# EAGLE design AppleMouse (EAGLE 7.6.0)
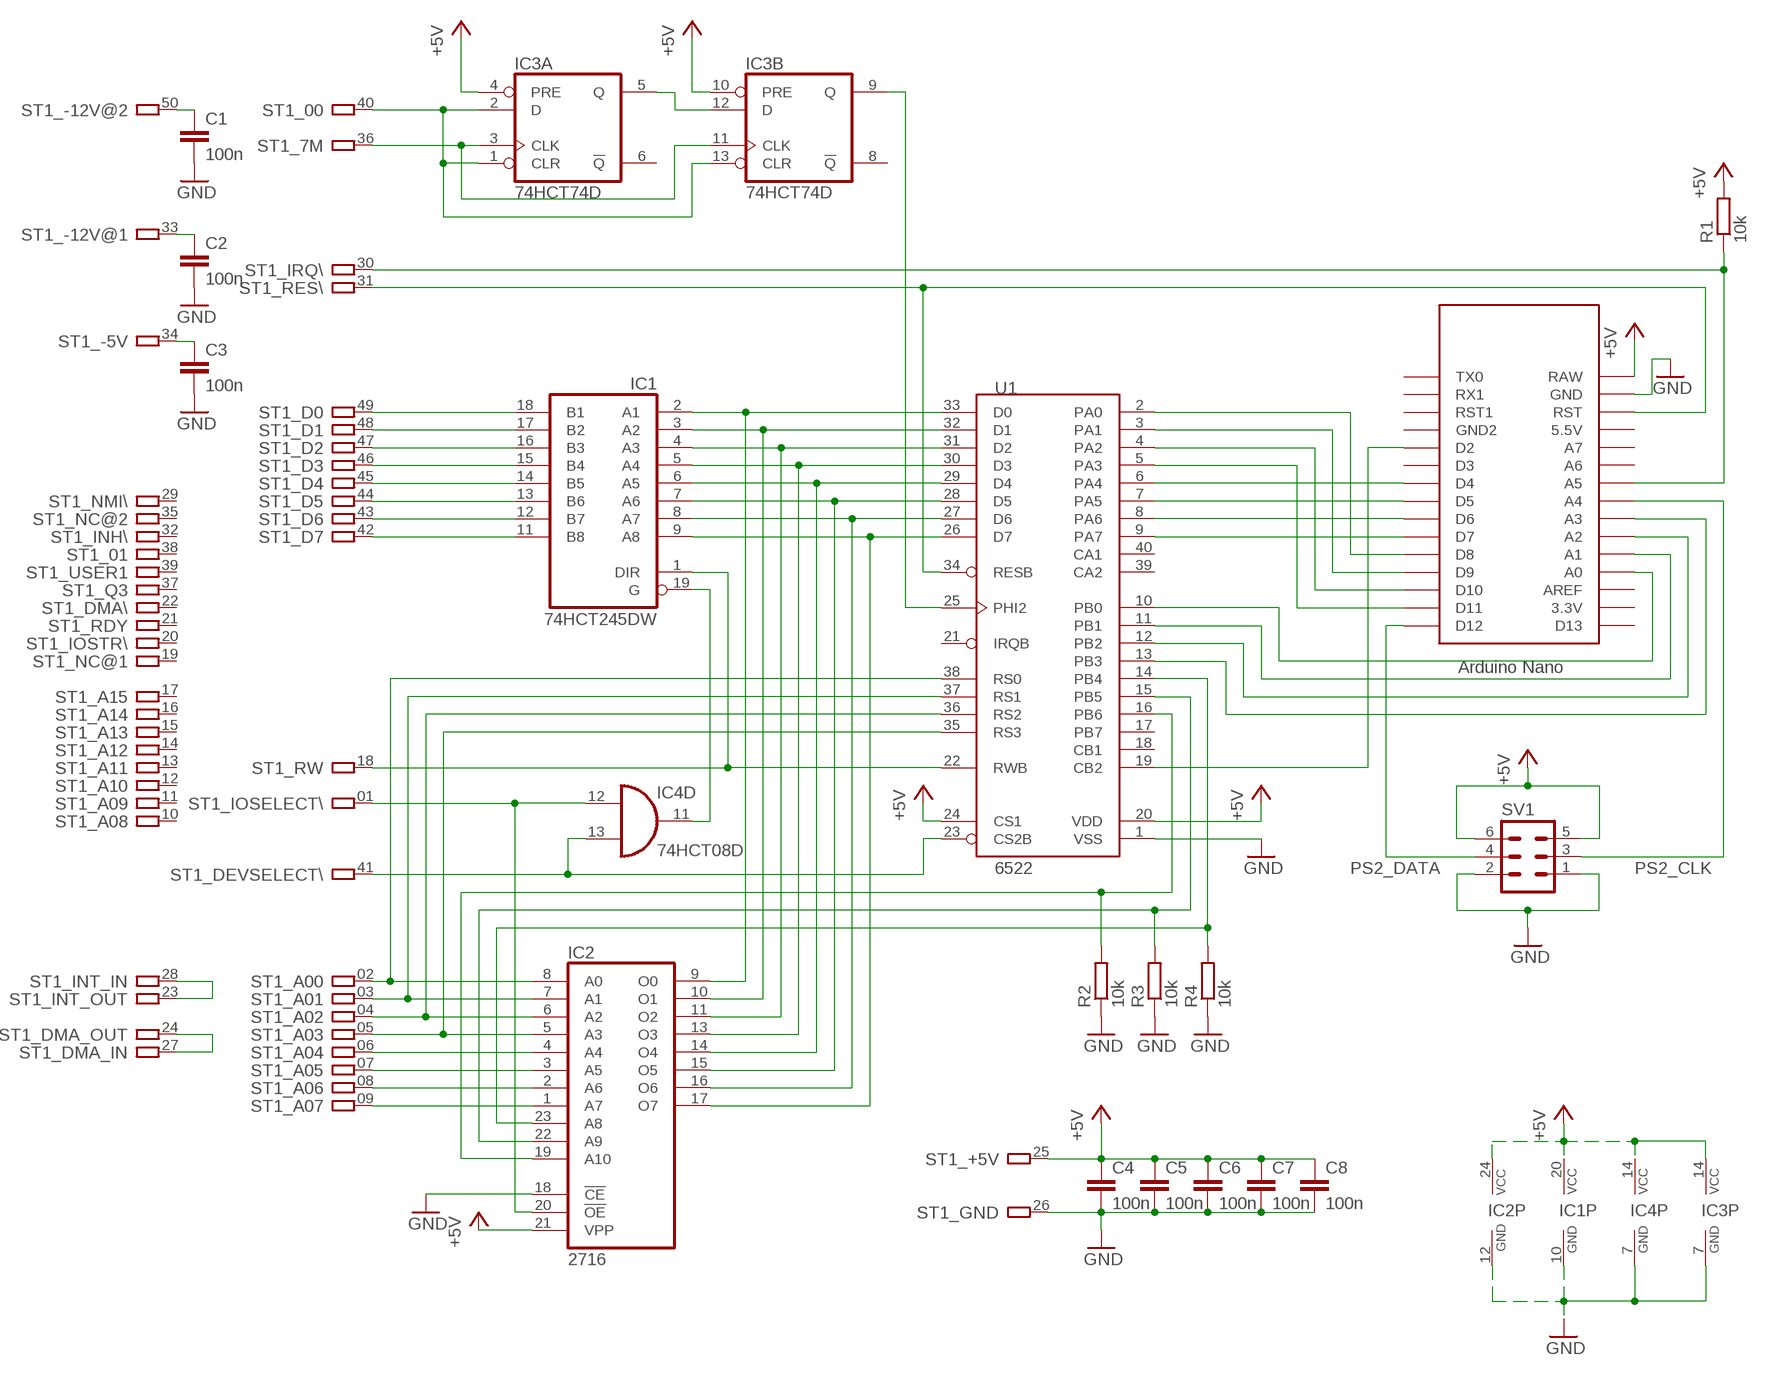
[diagram p0: schematic, sheet 1]

## Parts
C1  100n  C-EUC0805  [C0805]
C2  100n  C-EUC0805  [C0805]
C3  100n  C-EUC0805  [C0805]
C4  100n  C-EUC0805  [C0805]
C5  100n  C-EUC0805  [C0805]
C6  100n  C-EUC0805  [C0805]
C7  100n  C-EUC0805  [C0805]
C8  100n  C-EUC0805  [C0805]
IC1  74HCT245DW  [SO20W]
IC2  2716  [DIL24]
IC3  74HCT74D  [SO14]
IC4  74HCT08D  [SO14]
R1  10k  R-EU_R0805  [R0805]
R2  10k  R-EU_R0805  [R0805]
R3  10k  R-EU_R0805  [R0805]
R4  10k  R-EU_R0805  [R0805]
ST1  A2-50PINSLOT1-3  [A2-50PIN-SL1-3]
SV1  ML6  [ML6]
U1  6522  W65C22DIP40  [DIP40]
U$1  NANO  [NANO]

## Nets
+5V: C4.1 C5.1 C6.1 C7.1 C8.1 IC1.20(VCC) IC2.21(VPP) IC2.24(VCC) IC3.4(A:PRE) IC3.10(B:PRE) IC3.14(P:VCC) IC4.14(P:VCC) R1.2 ST1.25 SV1.5 SV1.6 U1.20(VDD) U1.24(CS1) U$1.RAW
GND: C1.2 C2.2 C3.2 C4.2 C5.2 C6.2 C7.2 C8.2 IC1.10(GND) IC2.12(GND) IC2.18(!CE) IC3.7(P:GND) IC4.7(P:GND) R2.1 R3.1 R4.1 ST1.26 SV1.1 SV1.2 U1.1(VSS) U$1.GND
N$1: IC1.18(B1) ST1.49
N$2: IC1.17(B2) ST1.48
N$3: IC1.16(B3) ST1.47
N$4: IC1.15(B4) ST1.46
N$5: IC1.14(B5) ST1.45
N$6: IC1.13(B6) ST1.44
N$7: IC1.12(B7) ST1.43
N$8: IC1.11(B8) ST1.42
N$9: IC1.5(A4) IC2.13(O3) U1.30(D3)
N$10: IC1.4(A3) IC2.11(O2) U1.31(D2)
N$11: IC1.3(A2) IC2.10(O1) U1.32(D1)
N$12: IC1.2(A1) IC2.9(O0) U1.33(D0)
N$13: IC1.9(A8) IC2.17(O7) U1.26(D7)
N$14: IC1.7(A6) IC2.15(O5) U1.28(D5)
N$15: IC1.8(A7) IC2.16(O6) U1.27(D6)
N$16: R1.1 ST1.30 U$1.A5
N$17: ST1.31 U1.34(RESB) U$1.RST
N$18: U1.13(PB3) U$1.A3
N$19: IC2.20(!OE) IC4.12(D:I0) ST1.01
N$20: U1.10(PB0) U$1.A0
N$21: IC2.7(A1) ST1.03 U1.37(RS1)
N$22: U1.12(PB2) U$1.A2
N$23: IC2.5(A3) ST1.05 U1.35(RS3)
N$24: IC2.4(A4) ST1.06
N$25: IC2.3(A5) ST1.07
N$26: IC2.2(A6) ST1.08
N$27: IC2.1(A7) ST1.09
N$28: IC1.1(DIR) ST1.18 U1.22(RWB)
N$29: C1.1 ST1.50
N$30: C2.1 ST1.33
N$31: ST1.24 ST1.27
N$32: ST1.23 ST1.28
N$33: C3.1 ST1.34
N$34: U1.19(CB2) U$1.D2
N$35: IC2.8(A0) ST1.02 U1.38(RS0)
N$36: U1.11(PB1) U$1.A1
N$37: IC4.13(D:I1) ST1.41 U1.23(CS2B)
N$38: IC2.6(A2) ST1.04 U1.36(RS2)
N$39: IC1.6(A5) IC2.14(O4) U1.29(D4)
N$40: U1.3(PA1) U$1.D9
N$41: U1.2(PA0) U$1.D8
N$42: U1.4(PA2) U$1.D10
N$43: U1.5(PA3) U$1.D11
N$44: U1.6(PA4) U$1.D4
N$45: U1.7(PA5) U$1.D5
N$46: U1.8(PA6) U$1.D6
N$47: U1.9(PA7) U$1.D7
N$48: IC3.9(B:Q) U1.25(PHI2)
N$49: IC2.23(A8) R4.2 U1.14(PB4)
N$50: IC2.22(A9) R3.2 U1.15(PB5)
N$51: IC2.19(A10) R2.2 U1.16(PB6)
N$52: IC1.19(G) IC4.11(D:O)
N$53: IC3.5(A:Q) IC3.12(B:D)
N$54: IC3.1(A:CLR) IC3.2(A:D) IC3.13(B:CLR) ST1.40
N$55: IC3.3(A:CLK) IC3.11(B:CLK) ST1.36
PS2_CLK: SV1.3 U$1.A4
PS2_DATA: SV1.4 U$1.D12
Unconnected: IC3.6(A:!Q) IC3.8(B:!Q) IC4.1(A:I0) IC4.2(A:I1) IC4.3(A:O) IC4.4(B:I0) IC4.5(B:I1) IC4.6(B:O) IC4.8(C:O) IC4.9(C:I0) IC4.10(C:I1) ST1.10 ST1.11 ST1.12 ST1.13 ST1.14 ST1.15 ST1.16 ST1.17 ST1.19 ST1.20 ST1.21 ST1.22 ST1.29 ST1.32 ST1.35 ST1.37 ST1.38 ST1.39 U1.17(PB7) U1.18(CB1) U1.21(IRQB) U1.39(CA2) U1.40(CA1) U$1.3.3V U$1.5V(5.5V) U$1.A6 U$1.A7 U$1.AREF U$1.D3 U$1.D13 U$1.GND1(GND2) U$1.ICSP1 U$1.ICSP2 U$1.ICSP3 U$1.ICSP4 U$1.ICSP5 U$1.ICSP6 U$1.RST1 U$1.RX1 U$1.TX0

## Library data of the parts
C1-C8 = rcl:C-EU: CAPACITOR, European symbol
IC1 = 74xx-eu:74*245: Octal BUS TRANSCEIVER, 3-state
IC2 = memory:2716: MEMORY
IC3 = 74xx-eu:74*74: Dual D type positive edge triggered FLIP FLOP, preset and clear
IC4 = 74xx-eu:74*08: Quad 2-input AND gate
R1-R4 = rcl:R-EU_: RESISTOR, European symbol
ST1 = con-apple2:A2-50PIN: Apple ][ Peripheral Card Connector This is the, default, 50-pin connector for slot #1 to #7 Pins are laid out as seen from the top of the slot
SV1 = con-harting-ml:ML6: HARTING; OC_FARNELL: unknown; OC_NEWARK: unknown
U1 = pda:W65C22: The W65C22 (W65C22N and W65C22S) Versatile Interface Adapter (VIA) is a flexible I/O device for use with the 65xx series microprocessor family. The W65C22 includes functions for programmed control of two peripheral ports (Ports A and B). Two program controlled 8-bit bidirectional peripheral I/O ports allow direct interfacing between the microprocessor and selected peripheral units. Each port has input data latching capability. Two programmable Data Direction Registers (A and B) allow selection of data direction (input or output) on an individual line basis. Also provided are two programmable 16-bit Interval Timer/Counters with latches. Timer 1 may be operated in a One-Shot Interrupt Mode with interrupts on each count to zero, or in a Free-Run Mode with a continuous series of evenly spaced interrupts. Timer 2 functions as both an interval and pulse counter. Serial Data transfers are provided by a serial to parallel/parallel to serial shift register. Application versatility is further increased by various control registers, including an Interrupt Flag Register, an Interrupt Enable Register and two Function Control Registers.
U$1 = Arduino-clone:NANO: Arduino Nano

## Board
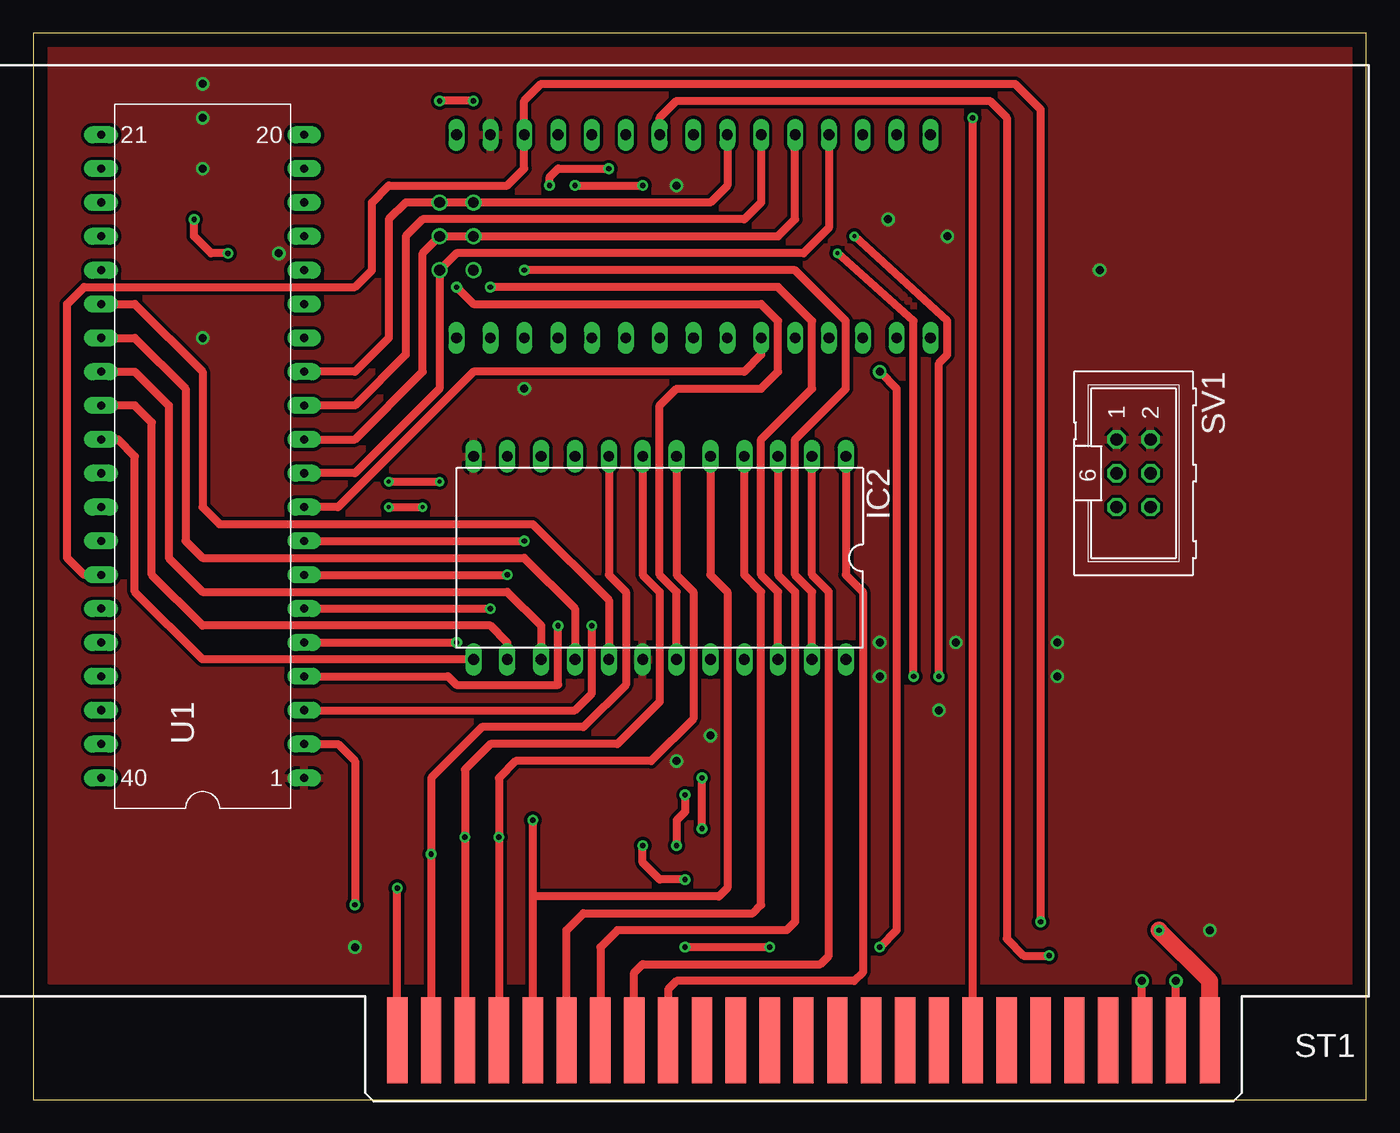
[diagram p1: board, top side]
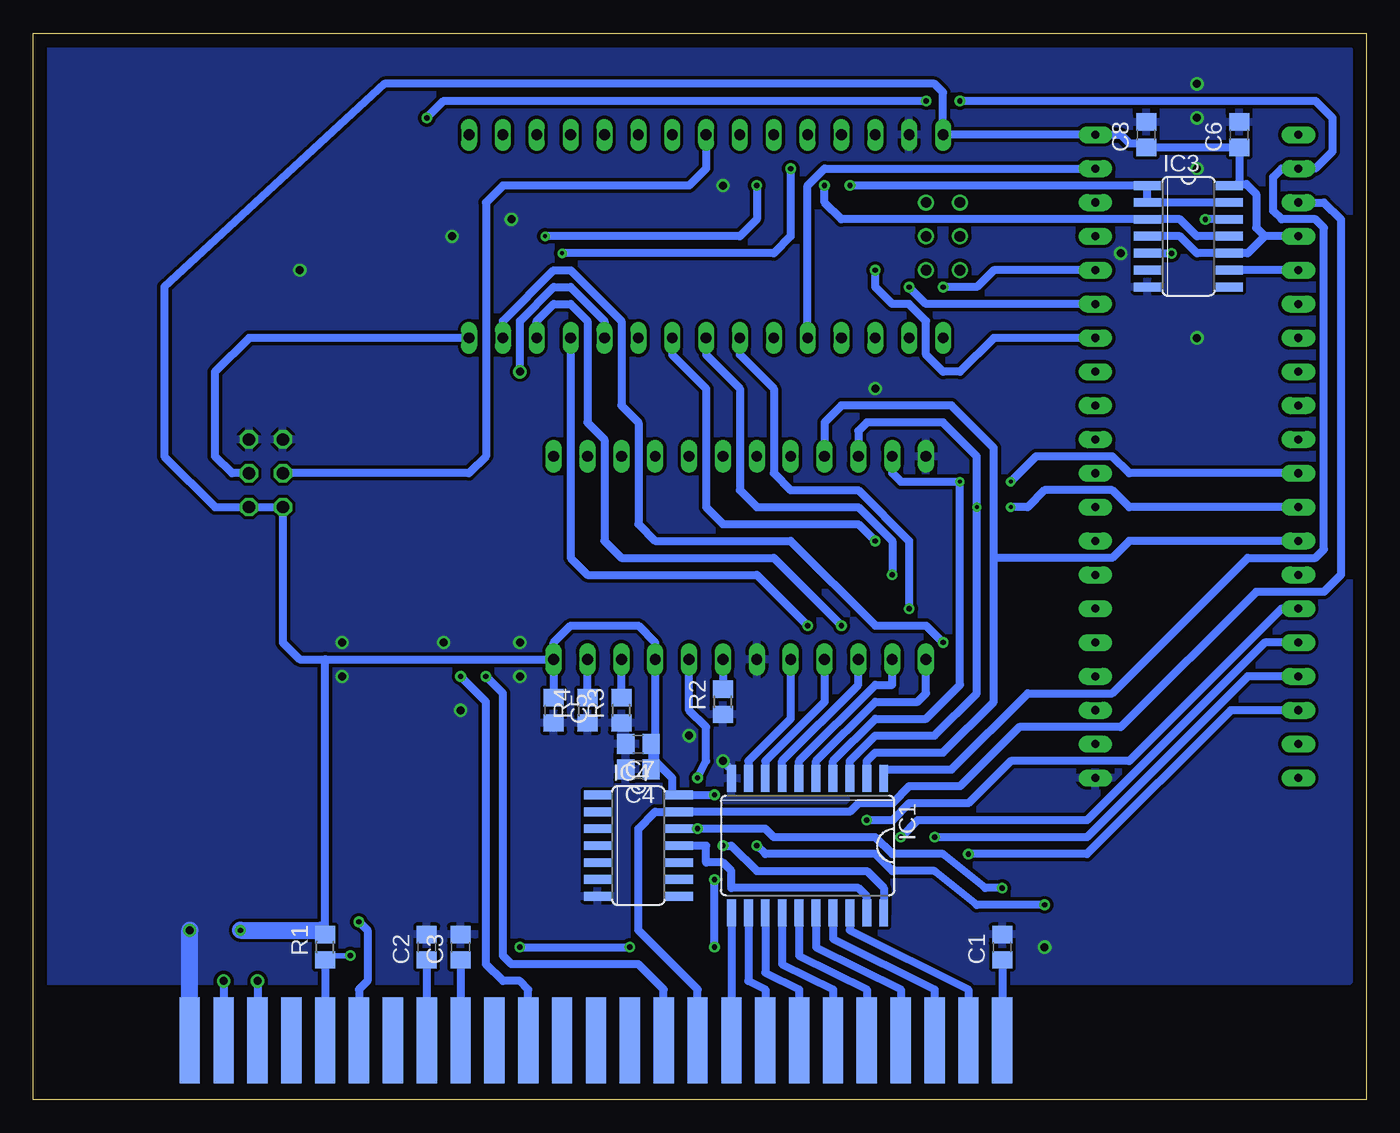
[diagram p2: board, bottom side, seen from below]

Size 100 x 80 mm. Coordinates in mm from the lower left corner, seen from the top.
Outline: 0,0 100,0 100,80 0,80 0,0
Copper layers (1*16): Top 0.035mm / dielectric 1.5mm / Bottom 0.035mm
Design rules "default *": minimum track width 10mil, minimum drill 24mil, track to track 6mil, track to pad 6mil, pad to pad 6mil, via to via 8mil, smd to smd 0mil, copper to edge 40mil, drill to drill 8mil, minimum pad ring 0.2mm, minimum via ring 0.2mm, stop-mask expansion 4mil, vias tented up to drill 0mil, thermal gap 10mil

### Footprints (pad centres in the part's own frame; a part is rotated, then mirrored left to right if it is on the bottom)
C0805 = smd 1.3 x 1.5: 1 -0.95,0; 2 0.95,0
SO20W = smd 0.66 x 2.032: 1 -5.715,-5.029; 2 -4.445,-5.029; 3 -3.175,-5.029; 4 -1.905,-5.029; 5 -0.635,-5.029; 6 0.635,-5.029; 7 1.905,-5.029; 8 3.175,-5.029; 9 4.445,-5.029; 10 5.715,-5.029; 11 5.715,5.029; 12 4.445,5.029; 13 3.175,5.029; 14 1.905,5.029; 15 0.635,5.029; 16 -0.635,5.029; 17 -1.905,5.029; 18 -3.175,5.029; 19 -4.445,5.029; 20 -5.715,5.029
DIL24 = drill 0.813 long: 1 -13.97,-7.62; 2 -11.43,-7.62; 3 -8.89,-7.62; 4 -6.35,-7.62; 5 -3.81,-7.62; 6 -1.27,-7.62; 7 1.27,-7.62; 8 3.81,-7.62; 9 6.35,-7.62; 10 8.89,-7.62; 11 11.43,-7.62; 12 13.97,-7.62; 13 13.97,7.62; 14 11.43,7.62; 15 8.89,7.62; 16 6.35,7.62; 17 3.81,7.62; 18 1.27,7.62; 19 -1.27,7.62; 20 -3.81,7.62; 21 -6.35,7.62; 22 -8.89,7.62; 23 -11.43,7.62; 24 -13.97,7.62
SO14 = smd 0.66 x 2.032: 1 -3.81,-3.073; 2 -2.54,-3.073; 3 -1.27,-3.073; 4 0,-3.073; 5 1.27,-3.073; 6 2.54,-3.073; 7 3.81,-3.073; 8 3.81,3.073; 9 2.54,3.073; 10 1.27,3.073; 11 0,3.073; 12 -1.27,3.073; 13 -2.54,3.073; 14 -3.81,3.073
R0805 = smd 1.3 x 1.5: 1 -0.95,0; 2 0.95,0
A2-50PIN-SL1-3 = smd 1.524 x 6.477: 01 -73.025,4.445; 02 -70.485,4.445; 03 -67.945,4.445; 04 -65.405,4.445; 05 -62.865,4.445; 06 -60.325,4.445; 07 -57.785,4.445; 08 -55.245,4.445; 09 -52.705,4.445; 10 -50.165,4.445; 11 -47.625,4.445; 12 -45.085,4.445; 13 -42.545,4.445; 14 -40.005,4.445; 15 -37.465,4.445; 16 -34.925,4.445; 17 -32.385,4.445; 18 -29.845,4.445; 19 -27.305,4.445; 20 -24.765,4.445; 21 -22.225,4.445; 22 -19.685,4.445; 23 -17.145,4.445; 24 -14.605,4.445; 25 -12.065,4.445 | smd 1.524 x 6.477 bottom: 26 -12.065,4.445; 27 -14.605,4.445; 28 -17.145,4.445; 29 -19.685,4.445; 30 -22.225,4.445; 31 -24.765,4.445; 32 -27.305,4.445; 33 -29.845,4.445; 34 -32.385,4.445; 35 -34.925,4.445; 36 -37.465,4.445; 37 -40.005,4.445; 38 -42.545,4.445; 39 -45.085,4.445; 40 -47.625,4.445; 41 -50.165,4.445; 42 -52.705,4.445; 43 -55.245,4.445; 44 -57.785,4.445; 45 -60.325,4.445; 46 -62.865,4.445; 47 -65.405,4.445; 48 -67.945,4.445; 49 -70.485,4.445; 50 -73.025,4.445
ML6 = drill 0.914 octagon: 1 -2.54,-1.27; 2 -2.54,1.27; 3 0,-1.27; 4 0,1.27; 5 2.54,-1.27; 6 2.54,1.27
DIP40 = drill 0.61 pad 1.27 long: 1 -24.13,-7.62; 2 -21.59,-7.62; 3 -19.05,-7.62; 4 -16.51,-7.62; 5 -13.97,-7.62; 6 -11.43,-7.62; 7 -8.89,-7.62; 8 -6.35,-7.62; 9 -3.81,-7.62; 10 -1.27,-7.62; 11 1.27,-7.62; 12 3.81,-7.62; 13 6.35,-7.62; 14 8.89,-7.62; 15 11.43,-7.62; 16 13.97,-7.62; 17 16.51,-7.62; 18 19.05,-7.62; 19 21.59,-7.62; 20 24.13,-7.62; 21 24.13,7.62; 22 21.59,7.62; 23 19.05,7.62; 24 16.51,7.62; 25 13.97,7.62; 26 11.43,7.62; 27 8.89,7.62; 28 6.35,7.62; 29 3.81,7.62; 30 1.27,7.62; 31 -1.27,7.62; 32 -3.81,7.62; 33 -6.35,7.62; 34 -8.89,7.62; 35 -11.43,7.62; 36 -13.97,7.62; 37 -16.51,7.62; 38 -19.05,7.62; 39 -21.59,7.62; 40 -24.13,7.62
NANO = drill 0.8 long: 3.3V -10.16,24.13; 5V -10.16,-1.27; A0 -10.16,19.05; A1 -10.16,16.51; A2 -10.16,13.97; A3 -10.16,11.43; A4 -10.16,8.89; A5 -10.16,6.35; A6 -10.16,3.81; A7 -10.16,1.27; AREF -10.16,21.59; D2 5.08,1.27; D3 5.08,3.81; D4 5.08,6.35; D5 5.08,8.89; D6 5.08,11.43; D7 5.08,13.97; D8 5.08,16.51; D9 5.08,19.05; D10 5.08,21.59; D11 5.08,24.13; D12 5.08,26.67; D13 -10.16,26.67; GND -10.16,-6.35; GND1 5.08,-1.27; RAW -10.16,-8.89; RST -10.16,-3.81; RST1 5.08,-3.81; RX1 5.08,-6.35; TX0 5.08,-8.89 | drill 0.8: ICSP1 -5.08,-10.16; ICSP2 -5.08,-7.62; ICSP3 -2.54,-10.16; ICSP4 -2.54,-7.62; ICSP5 0,-10.16; ICSP6 0,-7.62

### Placement (x,y rotation side)
C1  27.3,11.43 90 bottom
C2  70.48,11.43 90 bottom
C3  67.94,11.43 90 bottom
C4  54.61,24.77 180 bottom
C5  60.96,29.21 270 bottom
C6  9.53,72.39 90 bottom
C7  54.61,26.67 180 bottom
C8  16.51,72.39 90 bottom
IC1  41.91,19.05 180 bottom
IC2  46.99,40.64 180 top
IC3  13.34,64.77 270 bottom
IC4  54.61,19.05 270 bottom
R1  78.11,11.43 90 bottom
R2  48.26,29.84 90 bottom
R3  55.88,29.21 90 bottom
R4  58.42,29.21 90 bottom
ST1  100.33,0 0 top
SV1  82.55,46.99 270 top
U1  12.7,48.26 90 top
U$1  40.64,62.23 270 top

### Tracks (layer width: path | path; a pad name or v marks a point on that pad's centre or on a via)
+5V  (via drill 0.4)
  Top 0.61: v48.9,22.86 48.9,21.59 48.26,20.95 v48.26,19.05
  Top 1.27: ST1.25 88.27,8.89 v84.45,12.7
  Bottom 0.406: C7.1 C4.1 52.7,24.77
  Bottom 0.61: 36.14,13.97 IC1.20 36.2,15.88 37.47,17.14 45.72,17.14 47.62,19.05 v48.26,19.05 | U1.24 7.62,64.77 | 7.62,64.77 8.89,63.5 IC3.10 12.7,63.5 13.97,64.77 IC3.4 | 9.53,68.68 C6.1 C8.1 16.82,71.75 17.78,71.75 18.41,72.39 U1.20 U$1.RAW 31.75,75.56 32.38,76.2 73.66,76.2 90.17,60.96 90.17,48.26 86.36,44.45 SV1.6 SV1.5 81.28,34.29 80.01,33.02 78.11,33.02 | 9.53,68.68 IC3.14 | 9.53,68.68 8.99,68.68 8.26,67.94 8.26,65.41 7.62,64.77 | IC2.24 C5.1 | 78.11,33.02 IC2.24 | IC2.24 60.96,34.29 59.69,35.56 54.61,35.56 53.34,34.29 IC2.21 53.34,25.4 52.7,24.77 52.07,24.13 52.07,22.86 IC4.14 v48.9,22.86 | R1.2 78.11,33.02
  Bottom 1.27: v84.45,12.7 78.42,12.7 R1.2
GND  (via drill 0.6)
  Bottom 0.61: 47.94,25.08 47.62,24.77
  Bottom 1.27: ST1.26 v88.27,12.7
  other vias: 50.8,27.3 48.26,25.4 12.7,57.15 80.01,62.23 68.58,64.77 64.14,66.04 48.26,68.58 36.83,53.34 69.22,34.29 67.94,29.21 24.13,11.43 76.83,34.29 76.83,31.75 63.5,34.29 63.5,31.75 12.7,76.2 12.7,73.66 12.7,69.85 18.41,63.5
  pour Bottom (isolate 0.25): 1.27,78.74 99.06,78.74 99.06,8.89 1.27,8.89
  pour Top (isolate 0.25): 1.27,78.74 99.06,78.74 99.06,8.89 1.27,8.89
N$1
  Bottom 0.61: IC1.18 38.73,12.7 29.84,8.26 ST1.49
N$2
  Bottom 0.61: IC1.17 40.01,12.06 32.38,8.26 ST1.48
N$3
  Bottom 0.61: IC1.16 41.27,11.43 34.92,8.26 ST1.47
N$4
  Bottom 0.61: IC1.15 42.55,10.79 37.47,8.26 ST1.46
N$5
  Bottom 0.61: IC1.14 43.81,10.16 40.01,8.26 ST1.45
N$6
  Bottom 0.61: IC1.13 45.09,9.53 42.55,8.26 ST1.44
N$7
  Bottom 0.61: IC1.12 46.35,8.89 45.09,8.26 ST1.43
N$8
  Bottom 0.61: IC1.11 ST1.42
N$9
  Top 0.61: IC2.13 12.7,33.02 7.62,38.1 7.62,48.26 6.35,49.53 U1.30
  Bottom 0.61: IC1.5 41.27,25.4 36.83,29.84 33.66,29.84 33.02,30.48 IC2.13
N$10  (via drill 0.3)
  Top 0.61: v26.67,46.35 v30.48,46.35
  Bottom 0.61: IC1.4 40.01,25.4 36.83,28.57 33.02,28.57 30.48,31.11 v30.48,46.35 34.92,46.35 35.56,46.99 IC2.11 | U1.31 17.78,46.99 19.05,48.26 24.77,48.26 v26.67,46.35
N$11  (via drill 0.3)
  Top 0.61: v26.67,44.45 v29.21,44.45
  Bottom 0.61: IC1.3 38.73,25.4 36.83,27.3 32.38,27.3 29.21,30.48 v29.21,44.45 29.21,48.26 31.75,50.8 37.47,50.8 38.1,50.16 IC2.10 | U1.32 17.78,44.45 19.05,45.72 24.13,45.72 25.4,44.45 v26.67,44.45
N$12
  Bottom 0.61: IC1.2 37.47,25.4 36.83,26.04 31.75,26.04 27.94,29.84 27.94,40.64 | 27.94,40.64 27.94,48.9 31.11,52.07 39.37,52.07 40.64,50.8 IC2.9 | U1.33 17.78,41.91 19.05,40.64 27.94,40.64
N$13
  Top 0.61: U1.26 7.62,59.69 12.7,54.61 12.7,44.45 13.97,43.18 37.47,43.18 43.18,37.47 IC2.17
  Bottom 0.61: IC2.17 43.18,28.57 46.35,25.4 IC1.9
N$14
  Top 0.61: U1.28 7.62,54.61 10.16,52.07 10.16,40.64 12.7,38.1 35.56,38.1 38.1,35.56 IC2.15
  Bottom 0.61: IC1.7 43.81,25.4 38.1,31.11 IC2.15
N$15
  Top 0.61: U1.27 7.62,57.15 11.43,53.34 11.43,41.91 12.7,40.64 36.83,40.64 40.64,36.83 IC2.16
  Bottom 0.61: IC2.16 40.64,29.84 45.09,25.4 IC1.8
N$16  (via drill 0.4)
  Top 0.61: U$1.A5 46.99,73.66 48.26,74.93 71.75,74.93 73.03,73.66 73.03,12.06 74.3,10.79 v76.2,10.79
  Bottom 0.406: v76.2,10.79 77.79,10.79 R1.1
  Bottom 0.61: R1.1 ST1.30
N$17  (via drill 0.4)
  Top 0.61: U1.34 3.81,39.37 2.54,40.64 2.54,59.69 3.81,60.96 24.13,60.96 25.4,62.23 25.4,67.31 26.67,68.58 35.56,68.58 36.83,69.85 U$1.RST 36.83,74.93 38.1,76.2 73.66,76.2 75.56,74.3 v75.56,13.34
  Bottom 0.61: v75.56,13.34 74.93,12.7 74.93,8.89 75.56,8.26 ST1.31
N$18
  Top 0.61: U$1.A3 52.07,68.58 50.8,67.31 27.94,67.31 26.67,66.04 26.67,57.15 24.13,54.61 U1.13
N$19  (via drill 0.4)
  Top 0.61: ST1.01 v27.3,15.88 | v50.16,20.32 v50.16,24.13
  Bottom 0.61: IC2.20 50.8,29.21 49.53,27.94 49.53,25.4 v50.16,24.13 | v27.3,15.88 28.57,15.88 31.75,18.41 35.56,18.41 36.83,19.68 44.45,19.68 45.09,20.32 v50.16,20.32 IC4.12
N$20
  Top 0.61: U$1.A0 59.69,65.41 57.78,63.5 31.75,63.5 30.48,62.23 30.48,53.34 24.13,46.99 U1.10
N$21  (via drill 0.4)
  Top 0.61: IC2.7 45.72,39.37 46.99,38.1 46.99,29.84 43.81,26.67 34.29,26.67 32.38,24.77 v32.38,19.68 ST1.03
  Bottom 0.61: U1.37 8.89,31.75 20.95,19.68 v32.38,19.68
N$22
  Top 0.61: U$1.A2 54.61,67.31 53.34,66.04 29.21,66.04 27.94,64.77 27.94,55.88 24.13,52.07 U1.12
N$23  (via drill 0.4)
  Top 0.61: IC2.5 50.8,39.37 52.07,38.1 52.07,15.88 51.44,15.24 37.47,15.24 | 37.47,15.24 ST1.05 | v37.47,20.95 37.47,15.24
  Bottom 0.61: U1.35 6.35,36.83 17.78,25.4 26.67,25.4 29.84,22.23 34.29,22.23 35.56,20.95 v37.47,20.95
N$24
  Top 0.61: ST1.06 40.01,12.7 41.27,13.97 53.98,13.97 54.61,14.61 54.61,38.1 53.34,39.37 IC2.4
N$25
  Top 0.61: IC2.3 55.88,39.37 57.15,38.1 57.15,13.34 56.52,12.7 43.81,12.7 42.55,11.43 ST1.07
N$26
  Top 0.61: ST1.08 45.09,9.53 45.72,10.16 59.05,10.16 59.69,10.79 59.69,38.1 58.42,39.37 IC2.2
N$27
  Top 0.61: IC2.1 60.96,39.37 62.23,38.1 62.23,9.53 61.59,8.89 48.26,8.89 47.62,8.26 ST1.09
N$28  (via drill 0.4)
  Top 0.61: ST1.18 v70.48,73.66 | v33.02,74.93 v30.48,74.93
  Bottom 0.61: IC1.1 36.2,24.77 31.11,24.77 25.4,30.48 19.05,30.48 8.89,40.64 3.81,40.64 3.17,41.27 3.17,65.41 3.81,66.04 6.35,66.04 6.99,66.67 6.99,69.22 6.35,69.85 U1.22 3.81,69.85 2.54,71.12 2.54,73.66 3.81,74.93 v30.48,74.93 | v70.48,73.66 69.22,74.93 v33.02,74.93
N$29
  Bottom 0.61: C1.1 ST1.50
N$30
  Bottom 0.61: C2.1 ST1.33
N$31  (via drill 0.6)
  Top 0.61: ST1.27 v85.72,8.89
  Bottom 0.61: v85.72,8.89 ST1.27
N$32  (via drill 0.6)
  Top 0.61: ST1.23 v83.19,8.89
  Bottom 0.61: v83.19,8.89 ST1.23
N$33
  Bottom 0.61: C3.1 ST1.34
N$34
  Bottom 0.61: U$1.D2 41.91,68.58 40.64,69.85 U1.19
N$35  (via drill 0.4)
  Top 0.61: IC2.8 43.18,39.37 44.45,38.1 44.45,31.11 41.27,27.94 33.66,27.94 29.84,24.13 v29.84,18.41 ST1.02
  Bottom 0.61: U1.38 10.16,29.21 20.95,18.41 v29.84,18.41
N$36
  Top 0.61: U1.11 24.13,49.53 29.21,54.61 29.21,63.5 30.48,64.77 55.88,64.77 57.15,66.04 U$1.A1
N$37
  Bottom 0.61: ST1.41 50.16,8.26 54.61,12.7 54.61,20.32 53.34,21.59 IC4.13 38.73,21.59 38.1,22.23 35.56,22.23 34.29,23.5 30.48,23.5 26.04,27.94 18.41,27.94 8.26,38.1 3.17,38.1 1.91,39.37 1.91,66.04 3.17,67.31 U1.23
N$38  (via drill 0.4)
  Top 0.61: IC2.6 48.26,39.37 49.53,38.1 49.53,28.57 46.35,25.4 36.2,25.4 34.92,24.13 v34.92,19.68 ST1.04
  Bottom 0.61: U1.36 7.62,34.29 20.95,20.95 33.66,20.95 v34.92,19.68
N$39
  Top 0.61: IC2.14 35.56,34.29 34.29,35.56 12.7,35.56 8.89,39.37 8.89,50.8 7.62,52.07 U1.29
  Bottom 0.61: IC1.6 42.55,25.4 36.83,31.11 35.56,31.11 IC2.14
N$40  (via drill 0.4)
  Top 0.61: U1.3 40.64,29.21 41.91,30.48 v41.91,35.56
  Bottom 0.61: U$1.D9 59.69,40.64 58.42,39.37 45.72,39.37 v41.91,35.56
N$41  (via drill 0.4, 0.6)
  Top 0.61: v63.5,54.61 64.77,53.34 64.77,12.7 v63.5,11.43 | U1.2 22.86,26.67 24.13,25.4 v24.13,14.61 | v55.24,11.43 v48.9,11.43 | v48.9,16.51 46.99,16.51 45.72,17.78 v45.72,19.05
  Bottom 0.61: v24.13,14.61 29.21,14.61 32.38,17.14 35.56,17.14 36.83,18.41 45.09,18.41 v45.72,19.05 | v63.5,11.43 v55.24,11.43 | v48.9,11.43 v48.9,16.51 | v63.5,54.61 63.5,58.42 60.96,60.96 59.69,60.96 57.15,58.42 U$1.D8
N$42  (via drill 0.4)
  Top 0.61: U1.4 31.11,31.75 31.75,31.11 39.37,31.11 v39.37,35.56
  Bottom 0.61: U$1.D10 62.23,58.42 60.96,59.69 59.69,59.69 58.42,58.42 58.42,50.8 57.15,49.53 57.15,41.91 55.88,40.64 44.45,40.64 v39.37,35.56
N$43  (via drill 0.4)
  Top 0.61: U1.5 v31.75,34.29
  Bottom 0.61: U$1.D11 64.77,58.42 60.96,62.23 59.69,62.23 55.88,58.42 55.88,52.07 54.61,50.8 54.61,43.18 53.34,41.91 43.18,41.91 36.83,35.56 33.02,35.56 v31.75,34.29
N$44  (via drill 0.4)
  Top 0.61: U1.6 v34.29,36.83
  Bottom 0.61: v34.29,36.83 34.29,41.91 38.1,45.72 43.18,45.72 44.45,46.99 44.45,53.34 46.99,55.88 U$1.D4
N$45  (via drill 0.4)
  Top 0.61: U1.7 v35.56,39.37
  Bottom 0.61: v35.56,39.37 35.56,41.91 38.1,44.45 45.72,44.45 46.99,45.72 46.99,53.34 49.53,55.88 U$1.D5
N$46  (via drill 0.4)
  Top 0.61: U1.8 v36.83,41.91
  Bottom 0.61: v36.83,41.91 38.1,43.18 48.26,43.18 49.53,44.45 49.53,53.34 52.07,55.88 U$1.D6
N$47
  Top 0.61: U$1.D7 54.61,55.88 53.34,54.61 33.02,54.61 22.86,44.45 U1.9
N$48
  Bottom 0.61: U1.25 IC3.9
N$49  (via drill 0.4)
  Top 0.61: IC2.23 58.42,38.1 57.15,39.37 57.15,49.53 60.96,53.34 60.96,58.42 57.15,62.23 v36.83,62.23
  Bottom 0.61: U1.14 27.94,57.15 30.48,54.61 31.75,54.61 33.02,55.88 33.02,58.42 34.29,59.69 35.56,59.69 36.83,60.96 v36.83,62.23 | R4.2 IC2.23
N$50  (via drill 0.4)
  Top 0.61: IC2.22 55.88,38.1 54.61,39.37 54.61,49.53 58.42,53.34 58.42,58.42 55.88,60.96 v34.29,60.96
  Bottom 0.61: U1.15 33.02,59.69 v34.29,60.96 | R3.2 IC2.22
N$51  (via drill 0.4)
  Top 0.61: IC2.19 48.26,38.1 46.99,39.37 46.99,52.07 48.26,53.34 54.61,53.34 55.88,54.61 55.88,58.42 54.61,59.69 33.02,59.69 v31.75,60.96
  Bottom 0.61: U1.16 27.94,62.23 29.21,60.96 v31.75,60.96 | IC2.19 R2.2
N$52
  Bottom 0.61: IC1.19 37.47,15.24 38.1,15.88 47.62,15.88 47.62,17.14 48.26,17.78 49.53,17.78 49.53,19.05 IC4.11
N$53  (via drill 0.4)
  Top 0.61: v14.61,63.5 13.34,63.5 12.06,64.77 v12.06,66.04
  Bottom 0.61: IC3.12 v12.06,66.04 | IC3.5 v14.61,63.5
N$54  (via drill 0.3, 0.4)
  Top 0.61: v66.04,31.75 66.04,58.42 v60.33,63.5 | v38.73,68.58 38.73,69.22 39.37,69.85 v43.18,69.85
  Bottom 0.61: IC3.13 IC3.2 | IC3.2 IC3.1 | ST1.40 52.7,8.26 54.61,10.16 64.14,10.16 64.77,10.79 64.77,30.48 v66.04,31.75 | IC3.2 16.41,68.48 16.51,68.58 v38.73,68.58 | v43.18,69.85 43.18,64.77 44.45,63.5 v60.33,63.5
N$55  (via drill 0.3, 0.4)
  Top 0.61: v67.94,31.75 67.94,55.24 68.58,55.88 68.58,58.42 v61.59,64.77 | v40.64,68.58 v45.72,68.58
  Bottom 0.61: IC3.11 12.7,64.77 13.97,66.04 IC3.3 39.37,66.04 40.64,67.31 v40.64,68.58 | ST1.36 62.87,8.26 63.5,8.89 64.77,8.89 66.04,10.16 66.04,29.84 v67.94,31.75 | v45.72,68.58 45.72,66.04 46.99,64.77 v61.59,64.77
PS2_CLK
  Bottom 0.61: U$1.A4 49.53,69.85 50.8,68.58 64.77,68.58 66.04,67.31 66.04,48.26 67.31,46.99 SV1.3
PS2_DATA
  Bottom 0.61: U$1.D12 83.82,57.15 86.36,54.61 86.36,48.26 85.09,46.99 SV1.4